# Altium project T8_SOM_Carrier.PrjPcb (part 3 of 4)

## Sheet ETHERNET.SchDoc: ETHERHET
size 420 x 297 mm; DrawnBy: Orhun Dabak; Revision: 1.0; SheetNumber: 5; SheetTotal: 8
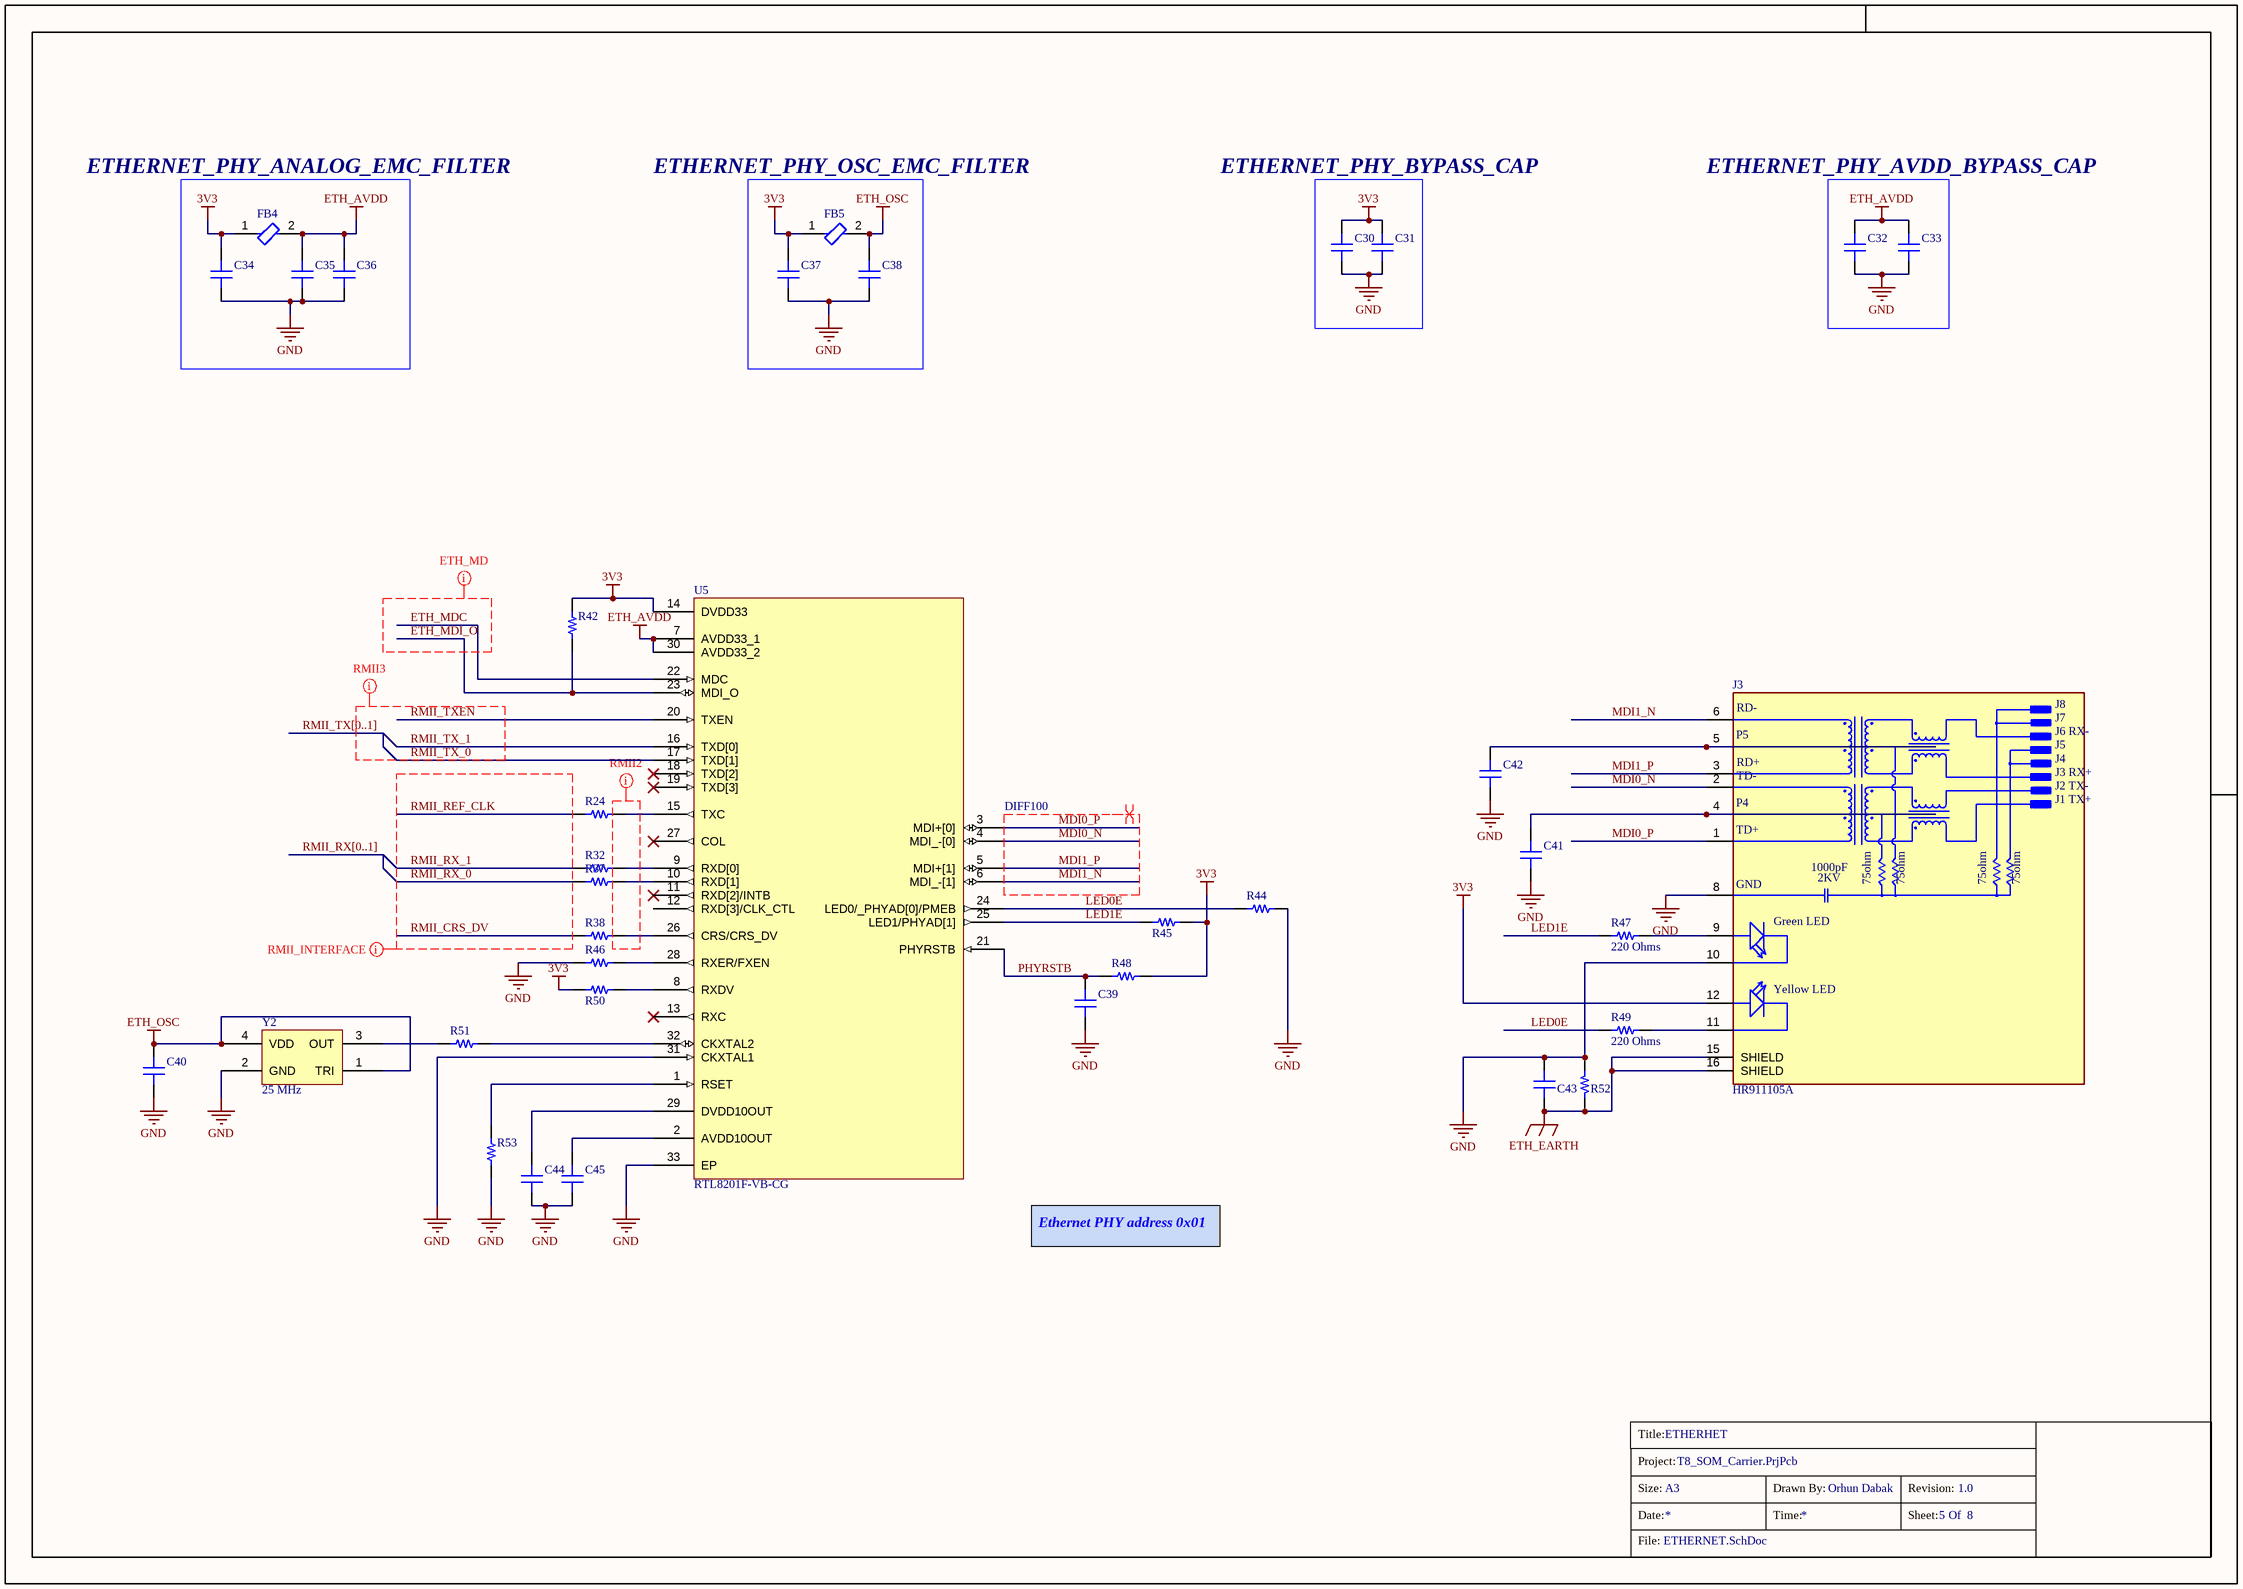
[diagram p4: ETHERNET.SchDoc]

### Parts
(Parts that share a designator on the sheet are numbered #1, #2 ... from top to bottom, then left to right.)
?#5  (no value)  (graphical)
C30  0.1 µF  [CAP 0402_1005]  (value not drawn)
C31  2.2 µF  [CAP 0402_1005]  (value not drawn)
C32  0.1 µF  [CAP 0402_1005]  (value not drawn)
C33  0.1 µF  [CAP 0402_1005]  (value not drawn)
C34  0.1 µF  [CAP 0402_1005]  (value not drawn)
C35  0.1 µF  [CAP 0402_1005]  (value not drawn)
C36  4.7 µF  [CAP 0402_1005]  (value not drawn)
C37  4.7 µF  [CAP 0402_1005]  (value not drawn)
C38  4.7 µF  [CAP 0402_1005]  (value not drawn)
C39  1000pF  [CAP 0402_1005]  (value not drawn)
C40  0.1 µF  [CAP 0402_1005]  (value not drawn)
C41  10000 pF  [CAP 0402_1005]  (value not drawn)
C42  10000 pF  [CAP 0402_1005]  (value not drawn)
C43  4700 pF  [CAP 0402_1005]  (value not drawn)
C44  0.1 µF  [CAP 0402_1005]  (value not drawn)
C45  0.1 µF  [CAP 0402_1005]  (value not drawn)
FB4  BLM15AX601SN1D  [FP-BLM15-0_05-IPC_B]  (value not drawn)
FB5  BLM15AX601SN1D  [FP-BLM15-0_05-IPC_B]  (value not drawn)
J3  HR911105A  [HANRUN_HR911105A]
R24  22 Ohms  [RES 0201_0603]  (value not drawn)
R32  22 Ohms  [RES 0201_0603]  (value not drawn)
R37  22 Ohms  [RES 0201_0603]  (value not drawn)
R38  22 Ohms  [RES 0201_0603]  (value not drawn)
R42  10 kOhms  [RES 0201_0603]  (value not drawn)
R44  4.7 kOhms  [RES 0201_0603]  (value not drawn)
R45  4.7 kOhms  [RES 0201_0603]  (value not drawn)
R46  4.7 kOhms  [RES 0201_0603]  (value not drawn)
R47  220 Ohms  [RES 0402_1005]
R48  4.7 kOhms  [RES 0201_0603]  (value not drawn)
R49  220 Ohms  [RES 0402_1005]
R50  10 kOhms  [RES 0201_0603]  (value not drawn)
R51  22 Ohms  [RES 0402_1005]  (value not drawn)
R52  1 MOhms  [RES 0402_1005]  (value not drawn)
R53  2.49 kOhms  [RES 0201_0603]  (value not drawn)
U5  RTL8201F-VB-CG  [QFN50P500X500X100_HS-33N]
Y2  25 MHz  [ABRACON ASE]

### Nets
3V3: C30.2 C31.2 C34.2 C37.2 FB4.1 FB5.1 J3.12(YA) R42.2 R45.1 R48.2 R50.2 U5.14(DVDD33)
ETH_AVDD: C32.2 C33.2 C35.2 C36.2 FB4.2 U5.7(AVDD33_1) U5.30(AVDD33_2)
ETH_EARTH: C43.1 J3.15(SHIELD) J3.16(SHIELD) R52.1
ETH_OSC: C38.2 C40.2 FB5.2 Y2.1(TRI) Y2.4(VDD)
GND: C30.1 C31.1 C32.1 C33.1 C34.1 C35.1 C36.1 C37.1 C38.1 C39.1 C40.1 C41.1 C42.1 C43.2 C44.1 C45.1 J3.8(GND) J3.10(GC) R44.2 R46.1 R52.2 R53.1 U5.31(CKXTAL1) U5.33(EP) Y2.2(GND)
ETH_MDC: U5.22(MDC)
ETH_MDI_O: R42.1 U5.23(MDI_O)
LED0E: R44.1 R49.2 U5.24(LED0/_PHYAD[0]/PMEB)
LED1E: R45.2 R47.2 U5.25(LED1/PHYAD[1])
MDI0_N: J3.2(TD-) U5.4(MDI_-[0])
MDI0_P: J3.1(TD+) U5.3(MDI+[0])
MDI1_N: J3.6(RD-) U5.6(MDI_-[1])
MDI1_P: J3.3(RD+) U5.5(MDI+[1])
PHYRSTB: C39.2 R48.1 U5.21(PHYRSTB)
RMII_CRS_DV: R38.1
RMII_REF_CLK: R24.1
RMII_RX_0: R37.1
RMII_RX_1: R32.1
RMII_TX_0: U5.17(TXD[1])
RMII_TX_1: U5.16(TXD[0])
RMII_TXEN: U5.20(TXEN)
NetC41_2: C41.2 J3.4(P4)
NetC42_2: C42.2 J3.5(P5)
NetC44_2: C44.2 U5.29(DVDD10OUT)
NetC45_2: C45.2 U5.2(AVDD10OUT)
NetJ3_9: J3.9(GA) R47.1
NetJ3_11: J3.11(YC) R49.1
NetR24_2: R24.2 U5.15(TXC)
NetR32_2: R32.2 U5.9(RXD[0])
NetR37_2: R37.2 U5.10(RXD[1])
NetR38_2: R38.2 U5.26(CRS/CRS_DV)
NetR46_2: R46.2 U5.28(RXER/FXEN)
NetR50_1: R50.1 U5.8(RXDV)
NetR51_1: R51.1 Y2.3(OUT)
NetR51_2: R51.2 U5.32(CKXTAL2)
NetR53_2: R53.2 U5.1(RSET)

Not connected (* = marked no-connect by the designer): U5 11(RXD[2]/INTB)* 12(RXD[3]/CLK_CTL) 13(RXC)* 18(TXD[2])* 19(TXD[3])* 27(COL)*

### Buses and harness runs
bus RMII_RX[0..1]
bus RMII_TX[0..1]

### Layout directives
net class SING_END50; net class RMII: RMII_CRS_DV, RMII_REF_CLK, RMII_RX_0, RMII_RX_1
differential pair; differential pair class DIFF100: MDI0_N, MDI0_P, MDI1_N, MDI1_P
net class RMII2; net class SING_END50: (no net found under the mark)
net class ETH_MD; net class SING_END50: ETH_MDC, ETH_MDI_O
net class RMII3; net class SING_END50: RMII_TX_0, RMII_TX_1, RMII_TXEN

### Notes on the sheet
- ETHERNET_PHY_ANALOG_EMC_FILTER
- ETHERNET_PHY_OSC_EMC_FILTER
- ETHERNET_PHY_BYPASS_CAP
- ETHERNET_PHY_AVDD_BYPASS_CAP
- Ethernet PHY address 0x01
- Title:
- Project:
- Size:
- Date:
- File:
- A3
- Time:
- Drawn By:
- Sheet:
- Revision:
- Of
- (in symbol HR911105A) J8; J7; J6 RX-; J5; J4; J3 RX+; J2 TX-; J1 TX+; 1000pF; 2KV; 75ohm; Green LED; Yellow LED

### Library data of the parts
?#5 = Title_Block
C30 C32-C35 C40 C44 C45 = CC0402KRX7R6BB104: CAP CER 0.1UF 10V X7R 0402; manufacturer: Yageo; Tolerance: ±10%; Part Number: CC0402KRX7R6BB104; Value: 0.1 µF; Applications: General Purpose; Capacitance: 0.1 µF; componentlink1description: Datasheet; componentlink1url: https://www.yageo.com/upload/media/product/productsearch/datasheet/mlcc/UPY-GPHC_X7R_6.3V-to-50V_18.pdf; componentlink2description: DigiKey Link; componentlink2url: https://www.digikey.com/en/products/detail/yageo/CC0402KRX7R6BB104/2103083; Device Package: 0402 (1005 Metric); lastupdated: 19/09/2022 12:57:28; Lifecycle Status: Active; Minimum Order: 1; Mounting Type: Surface Mount, MLCC; Operating Temperature: -55°C ~ 125°C; Package / Case: 0402 (1005 Metric); packaging: CutTape; partid: 3877; Part Status: Active; price: 0.01; series: CC; Size / Dimension: 0.039" L x 0.020" W (1.00mm x 0.50mm); Supplier 1: DigiKey; Supplier Part Number 1: 311-1345-1-ND; Temperature Coefficient: X7R; Thickness (Max): 0.022" (0.55mm); Voltage - Rated: 10V
C31 = C0402C225M8PAC7867: CAP CER 2.2UF 10V X5R 0402; manufacturer: KEMET; Tolerance: ±20%; Part Number: C0402C225M8PAC7867; Value: 2.2 µF; Applications: Bypass, Decoupling; Capacitance: 2.2 µF; componentlink1description: Datasheet; componentlink1url: https://connect.kemet.com:7667/gateway/IntelliData-ComponentDocumentation/1.0/download/datasheet/C0402C225M8PACTU; componentlink2description: DigiKey Link; componentlink2url: https://www.digikey.com/en/products/detail/kemet/C0402C225M8PAC7867/3317581; Device Package: 0402 (1005 Metric); lastupdated: 19/09/2022 12:56:38; Lifecycle Status: Active; Minimum Order: 1; Mounting Type: Surface Mount, MLCC; Operating Temperature: -55°C ~ 85°C; Package / Case: 0402 (1005 Metric); packaging: TapeAndReel; partid: 44976; Part Status: Active; price: 0.02; series: SMD Comm X5R; Size / Dimension: 0.039" L x 0.020" W (1.00mm x 0.50mm); Supplier 1: DigiKey; Supplier Part Number 1: 399-C0402C225M8PAC7867CT-ND; Temperature Coefficient: X5R; Thickness (Max): 0.022" (0.55mm); Voltage - Rated: 10V
C36-C38 = CL05A475MP5NRNC: CAP CER 4.7UF 10V X5R 0402; manufacturer: Samsung Electro-Mechanics; Tolerance: ±20%; Part Number: CL05A475MP5NRNC; Value: 4.7 µF; Applications: General Purpose; Capacitance: 4.7 µF; componentlink1description: Datasheet; componentlink1url: http://www.samsungsem.com/kr/support/product-search/mlcc/CL05A475MP5NRNC.jsp; componentlink2description: DigiKey Link; componentlink2url: https://www.digikey.com/en/products/detail/samsung-electro-mechanics/CL05A475MP5NRNC/3887140; Device Package: 0402 (1005 Metric); lastupdated: 19/09/2022 12:57:17; Lifecycle Status: Active; Minimum Order: 1; Mounting Type: Surface Mount, MLCC; Operating Temperature: -55°C ~ 85°C; Package / Case: 0402 (1005 Metric); packaging: TapeAndReel; partid: 7650; Part Status: Active; price: 0.01; series: CL; Size / Dimension: 0.039" L x 0.020" W (1.00mm x 0.50mm); Supplier 1: DigiKey; Supplier Part Number 1: 1276-1482-1-ND; Temperature Coefficient: X5R; Thickness (Max): 0.022" (0.55mm); Voltage - Rated: 10V
C39 = 0402ZC102KAT2A: CAP CER 1000PF 10V X7R 0402; manufacturer: AVX Corporation; Tolerance: ±10%; Part Number: 0402ZC102KAT2A; Value: 1000pF; Applications: General Purpose; Capacitance: 1000pF; componentlink1description: Datasheet; componentlink1url: http://datasheets.avx.com/X7RDielectric.pdf; componentlink2description: DigiKey Link; componentlink2url: http://digikey.com/product-detail/en/avx-corporation/0402ZC102KAT2A/478-12663-1-ND/9949195; Device Package: 0402 (1005 Metric); lastupdated: 08/02/2022 12:26:49; Lifecycle Status: Active; Minimum Order: 1; Mounting Type: Surface Mount, MLCC; Operating Temperature: -55°C ~ 125°C; Package / Case: 0402 (1005 Metric); packaging: TapeAndReel; partid: 7830; Part Status: Active; price: 0.01; series: -; Size / Dimension: 0.039" L x 0.020" W (1.00mm x 0.50mm); Supplier 1: DigiKey; Supplier Part Number 1: 478-12663-1-ND; Temperature Coefficient: X7R; Thickness (Max): 0.022" (0.56mm); Voltage - Rated: 10V
C41 C42 = C0402C103K5RECAUTO: CAP CER 0402 10NF 50V X7R 10%; manufacturer: KEMET; Part Number: C0402C103K5RECAUTO; Value: 10000 pF; Applications: Automotive, ESD Protection; Capacitance: 10000 pF; componentlink1description: Datasheet; componentlink1url: https://api.kemet.com/component-edge/download/datasheet/C0402C103K5RECAUTO.pdf; componentlink2description: DigiKey Link; componentlink2url: https://www.digikey.com/en/products/detail/kemet/C0402C103K5RECAUTO/8646477; Device Package: 0402 (1005 Metric); lastupdated: 19/09/2022 12:56:43; Lifecycle Status: Active; Minimum Order: 1; Mounting Type: Surface Mount, MLCC; Operating Temperature: -55°C ~ 125°C; Package / Case: 0402 (1005 Metric); packaging: TapeAndReel; partid: 38916; Part Status: Active; price: 0.01; Ratings: AEC-Q200; series: ESD SMD Auto X7R; Size / Dimension: 0.039" L x 0.020" W (1.00mm x 0.50mm); Supplier 1: DigiKey; Supplier Part Number 1: 399-C0402C103K5RECAUTOCT-ND; Temperature Coefficient: X7R; Thickness (Max): 0.022" (0.55mm); Tolerance: ±10%; Voltage - Rated: 50V
C43 = GRM155R72A472KA01D: CAP CER 4700PF 100V X7R 0402; manufacturer: Murata Electronics; Tolerance: ±10%; Part Number: GRM155R72A472KA01D; Value: 4700 pF; Applications: General Purpose; Capacitance: 4700 pF; componentlink1description: Datasheet; componentlink1url: https://www.murata.com/~/media/webrenewal/support/library/catalog/products/capacitor/mlcc/c02e.ashx?la=en-us; componentlink2description: DigiKey Link; componentlink2url: https://www.digikey.com/en/products/detail/murata-electronics/GRM155R72A472KA01D/965899; Device Package: 0402 (1005 Metric); lastupdated: 19/09/2022 12:57:33; Lifecycle Status: Active; Minimum Order: 1; Mounting Type: Surface Mount, MLCC; Operating Temperature: -55°C ~ 125°C; Package / Case: 0402 (1005 Metric); packaging: TapeAndReel; partid: 2046; Part Status: Active; price: 0.01; series: GRM; Size / Dimension: 0.039" L x 0.020" W (1.00mm x 0.50mm); Supplier 1: DigiKey; Supplier Part Number 1: 490-3885-1-ND; Temperature Coefficient: X7R; Thickness (Max): 0.022" (0.55mm); Voltage - Rated: 100V
FB4 FB5 = CMP-0686-00246-4: Chip Ferrite Bead, 0402, 600Ω @ 100MHz, 0.34Ω, 25%, 500mA; Material: Steel; DC Resistance (DCR): 340mR; Impedance: 600R; Number of Circuits: 1; Max Current Rating: 500mA; Core Material: Ferrite; Lead Free: Lead Free; Series: BLM15AX_SN; Number of Pins: 2; Package Quantity: 1; Length: 1mm; Height: 0.5mm; Width: 0.5mm; Packaging: Tape and Reel; RoHS Compliant: Yes; Test Frequency: 100MHz; Case Code (Imperial): 0402; Depth: 0.5mm; Case/Package: 0402; Min Operating Temperature: -55°C; Max Operating Temperature: 125°C; Max DC Current: 500mA; Current Rating: 500mA; REACH SVHC: No SVHC; Termination: SMD/SMT; Tolerance: 25%; Case Code (Metric): 1005; Number of Lines: 1; DC Resistance-Max: 340mR
J3 = HR911105A: DIP RJ45 Connector;; Package: None; MP: HR911105A; Value: *; Price: None; Availability: Unavailable
R24 R32 R37 R38 = ERJ-1GNF22R0C: RES SMD 22 OHM 1% 1/20W 0201; Manufacturer: Panasonic Electronic Components; Power (Watts): 0.05W, 1/20W; Temperature Coefficient: ±200ppm/°C; Part Number: ERJ-1GNF22R0C; Value: 22 Ohms; ComponentLink1Description: Datasheet; ComponentLink1URL: https://industrial.panasonic.com/cdbs/www-data/pdf/RDA0000/AOA0000C304.pdf; ComponentLink2Description: DigiKey Link; ComponentLink2URL: https://www.digikey.com/en/products/detail/panasonic-electronic-components/ERJ-1GNF22R0C/2035920; Composition: Thick Film; Device Package: 0201 (0603 Metric); Features: Automotive AEC-Q200; Height - Seated (Max): 0.010" (0.26mm); LastUpdated: 9/19/2022 01:09:14 PM; Lifecycle Status: Active; Minimum Order: 1; Number of Terminations: 2; Operating Temperature: -55°C ~ 125°C; Package / Case: 0201 (0603 Metric); Packaging: TapeAndReel; PartId: 823; Part Status: Active; Price: 0.01; Ratings: AEC-Q200; Resistance: 22 Ohms; Series: ERJ-1GN; Size / Dimension: 0.024" L x 0.012" W (0.60mm x 0.30mm); Supplier 1: DigiKey; Supplier Part Number 1: P122843CT-ND; Supplier Device Package: 0201; Tolerance: ±1%
R42 R50 = RC0201FR-0710KL: RES 10K OHM 1% 1/20W 0201; Manufacturer: Yageo; Power (Watts): 0.05W, 1/20W; Temperature Coefficient: ±200ppm/°C; Part Number: RC0201FR-0710KL; Value: 10 kOhms; ComponentLink1Description: Datasheet; ComponentLink1URL: https://www.yageo.com/upload/media/product/productsearch/datasheet/rchip/PYu-RC_Group_51_RoHS_L_10.pdf; ComponentLink2Description: DigiKey Link; ComponentLink2URL: https://www.digikey.com/en/products/detail/yageo/RC0201FR-0710KL/1948870; Composition: Thick Film; Device Package: 0201 (0603 Metric); Features: Moisture Resistant; Height - Seated (Max): 0.010" (0.26mm); LastUpdated: 19/09/2022 13:09:03; Lifecycle Status: Active; Minimum Order: 1; Number of Terminations: 2; Operating Temperature: -55°C ~ 125°C; Package / Case: 0201 (0603 Metric); Packaging: CutTape; PartId: 2281; Part Status: Active; Price: 0.01; Resistance: 10 kOhms; Series: RC_L; Size / Dimension: 0.024" L x 0.012" W (0.60mm x 0.30mm); Supplier 1: DigiKey; Supplier Part Number 1: 311-10.0KMCT-ND; Supplier Device Package: 0201; Tolerance: ±1%
R44-R46 R48 = RC0201FR-074K7L: RES 4.7K OHM 1% 1/20W 0201; Manufacturer: Yageo; Power (Watts): 0.05W, 1/20W; Temperature Coefficient: ±200ppm/°C; Part Number: RC0201FR-074K7L; Value: 4.7 kOhms; ComponentLink1Description: Datasheet; ComponentLink1URL: https://www.yageo.com/upload/media/product/productsearch/datasheet/rchip/PYu-RC_Group_51_RoHS_L_10.pdf; ComponentLink2Description: DigiKey Link; ComponentLink2URL: https://www.digikey.com/en/products/detail/yageo/RC0201FR-074K7L/1948894; Composition: Thick Film; Device Package: 0201 (0603 Metric); Features: Moisture Resistant; Height - Seated (Max): 0.010" (0.26mm); LastUpdated: 19/09/2022 13:09:03; Lifecycle Status: Active; Minimum Order: 1; Number of Terminations: 2; Operating Temperature: -55°C ~ 125°C; Package / Case: 0201 (0603 Metric); Packaging: CutTape; PartId: 2288; Part Status: Active; Price: 0.01; Resistance: 4.7 kOhms; Series: RC_L; Size / Dimension: 0.024" L x 0.012" W (0.60mm x 0.30mm); Supplier 1: DigiKey; Supplier Part Number 1: 311-4.70KMCT-ND; Supplier Device Package: 0201; Tolerance: ±1%
R47 R49 = RC0402FR-07220RL: RES 220 OHM 1% 1/16W 0402; Manufacturer: Yageo; Power (Watts): 0.063W, 1/16W; Temperature Coefficient: ±100ppm/°C; Part Number: RC0402FR-07220RL; Value: 220 Ohms; ComponentLink1Description: Datasheet; ComponentLink1URL: https://www.yageo.com/upload/media/product/productsearch/datasheet/rchip/PYu-RC_Group_51_RoHS_L_10.pdf; ComponentLink2Description: DigiKey Link; ComponentLink2URL: https://www.digikey.com/en/products/detail/yageo/RC0402FR-07220RL/726565; Composition: Thick Film; Device Package: 0402 (1005 Metric); Features: Moisture Resistant; Height - Seated (Max): 0.016" (0.40mm); LastUpdated: 19/09/2022 13:14:14; Lifecycle Status: Active; Minimum Order: 1; Number of Terminations: 2; Operating Temperature: -55°C ~ 155°C; Package / Case: 0402 (1005 Metric); Packaging: CutTape; PartId: 17956; Part Status: Active; Price: 0.01; Resistance: 220 Ohms; Series: RC_L; Size / Dimension: 0.039" L x 0.020" W (1.00mm x 0.50mm); Supplier 1: DigiKey; Supplier Part Number 1: 311-220LRCT-ND; Supplier Device Package: 0402; Tolerance: ±1%
R51 = RC0402FR-0722RL: RES 22 OHM 1% 1/16W 0402; Manufacturer: Yageo; Power (Watts): 0.063W, 1/16W; Temperature Coefficient: ±100ppm/°C; Part Number: RC0402FR-0722RL; Value: 22 Ohms; ComponentLink1Description: Datasheet; ComponentLink1URL: https://www.yageo.com/upload/media/product/productsearch/datasheet/rchip/PYu-RC_Group_51_RoHS_L_10.pdf; ComponentLink2Description: DigiKey Link; ComponentLink2URL: https://www.digikey.com/en/products/detail/yageo/RC0402FR-0722RL/726562; Composition: Thick Film; Device Package: 0402 (1005 Metric); Features: Moisture Resistant; Height - Seated (Max): 0.016" (0.40mm); LastUpdated: 19/09/2022 13:14:15; Lifecycle Status: Active; Minimum Order: 1; Number of Terminations: 2; Operating Temperature: -55°C ~ 155°C; Package / Case: 0402 (1005 Metric); Packaging: CutTape; PartId: 17600; Part Status: Active; Price: 0.01; Resistance: 22 Ohms; Series: RC_L; Size / Dimension: 0.039" L x 0.020" W (1.00mm x 0.50mm); Supplier 1: DigiKey; Supplier Part Number 1: 311-22.0LRCT-ND; Supplier Device Package: 0402; Tolerance: ±1%
R52 = AC0402FR-071ML: RES SMD 1M OHM 1% 1/16W 0402; Manufacturer: Yageo; Power (Watts): 0.063W, 1/16W; Temperature Coefficient: ±100ppm/°C; Part Number: AC0402FR-071ML; Value: 1 MOhms; ComponentLink1Description: Datasheet; ComponentLink1URL: https://www.yageo.com/upload/media/product/productsearch/datasheet/rchip/PYu-AC_51_RoHS_L_7.pdf; ComponentLink2Description: DigiKey Link; ComponentLink2URL: https://www.digikey.com/en/products/detail/yageo/AC0402FR-071ML/5895164; Composition: Thick Film; Device Package: 0402 (1005 Metric); Features: Automotive AEC-Q200, Moisture Resistant; Height - Seated (Max): 0.015" (0.37mm); LastUpdated: 19/09/2022 13:14:31; Lifecycle Status: Active; Minimum Order: 1; Number of Terminations: 2; Operating Temperature: -55°C ~ 155°C; Package / Case: 0402 (1005 Metric); Packaging: CutTape; PartId: 12043; Part Status: Active; Price: 0.01; Ratings: AEC-Q200; Resistance: 1 MOhms; Series: AC; Size / Dimension: 0.039" L x 0.020" W (1.00mm x 0.50mm); Supplier 1: DigiKey; Supplier Part Number 1: YAG3450CT-ND; Supplier Device Package: 0402; Tolerance: ±1%
R53 = RC0201FR-072K49L: RES 2.49K OHM 1% 1/20W 0201; Manufacturer: Yageo; Power (Watts): 0.05W, 1/20W; Temperature Coefficient: ±200ppm/°C; Part Number: RC0201FR-072K49L; Value: 2.49 kOhms; ComponentLink1Description: Datasheet; ComponentLink1URL: https://www.yageo.com/upload/media/product/productsearch/datasheet/rchip/PYu-RC_Group_51_RoHS_L_10.pdf; ComponentLink2Description: DigiKey Link; ComponentLink2URL: https://www.digikey.com/en/products/detail/yageo/RC0201FR-072K49L/3202399; Composition: Thick Film; Device Package: 0201 (0603 Metric); Features: Moisture Resistant; Height - Seated (Max): 0.010" (0.26mm); LastUpdated: 19/09/2022 13:09:06; Lifecycle Status: Active; Minimum Order: 1; Number of Terminations: 2; Operating Temperature: -55°C ~ 125°C; Package / Case: 0201 (0603 Metric); Packaging: CutTape; PartId: 1844; Part Status: Active; Price: 0.01; Resistance: 2.49 kOhms; Series: RC_L; Size / Dimension: 0.024" L x 0.012" W (0.60mm x 0.30mm); Supplier 1: DigiKey; Supplier Part Number 1: YAG2338CT-ND; Supplier Device Package: 0201; Tolerance: ±1%
U5 = RTL8201F-VB-CG: Physical Layer Transceivers 2.97V ~ 3.63V IEEE 802.3, 10/100 Base-T/TX/FX PHY MII, SNI, SMI QFN-32_5x5x05P Ethernet ICs ROHS; Manufacturer: Realtek Semicon; ComponentLink1Description: LCSC Link; ComponentLink1URL: https://www.lcsc.com/product-detail/Ethernet-ICs_Realtek-Semicon-RTL8201F-VB-CG_C45044.html; ComponentLink2Description: Datasheet; ComponentLink2URL: https://datasheetspdf.com/pdf-file/845737/Realtek/RTL8201F-VB-CG/1; Manufacturer Part Number: RTL8201F-VB-CG; Category: Communication Interface Chip/UART/485/232/Ethernet ICs; Type: Physical Layer Transceivers; Supply Voltage: 2.97V ~ 3.63V; Standards: IEEE 802.3, 10/100 Base-T/TX/FX PHY; Interface: MII, SNI, SMI; Package: QFN-32_5x5x05P; Supplier 1: Bison Technologies; Supplier Part Number 1: RTL8201F-VB-CG-220741-REALTEK; Supplier 2: Future Electronics; Supplier Part Number 2: 4019222
Y2 = ASE-25.000MHZ-ET: XTAL OSC XO 25.0000MHZ CMOS SMD; Manufacturer: Abracon LLC; Base Resonator: Crystal; Current - Supply (Max): 13mA; Frequency Stability: ±100ppm; Function: Enable/Disable; Voltage - Supply: 3.3V; Part Number: ASE-25.000MHZ-ET; ComponentLink1Description: Datasheet; ComponentLink1URL: https://abracon.com/Oscillators/ASEseries.pdf; ComponentLink2Description: DigiKey Link; ComponentLink2URL: https://www.digikey.com/en/products/detail/abracon-llc/ASE-25-000MHZ-ET/2001354; Frequency: 25 MHz; Height - Seated (Max): 0.047" (1.20mm); LastUpdated: 19/09/2022 13:51:44; Lifecycle Status: Active; Minimum Order: 1; Mounting Type: Surface Mount; Operating Temperature: -20°C ~ 70°C; Output: CMOS; Package / Case: 4-SMD, No Lead; Packaging: TapeAndReel; PartId: 149; Part Status: Active; Price: 0.88; Series: ASE; Size / Dimension: 0.126" L x 0.098" W (3.20mm x 2.50mm); Supplier 1: DigiKey; Supplier Part Number 1: 535-9987-1-ND; Type: XO (Standard); Value: 25 MHz

## Sheet ESP32_PD.SchDoc
size Legal; DrawnBy: Orhun Dabak; SheetNumber: 6; SheetTotal: 8
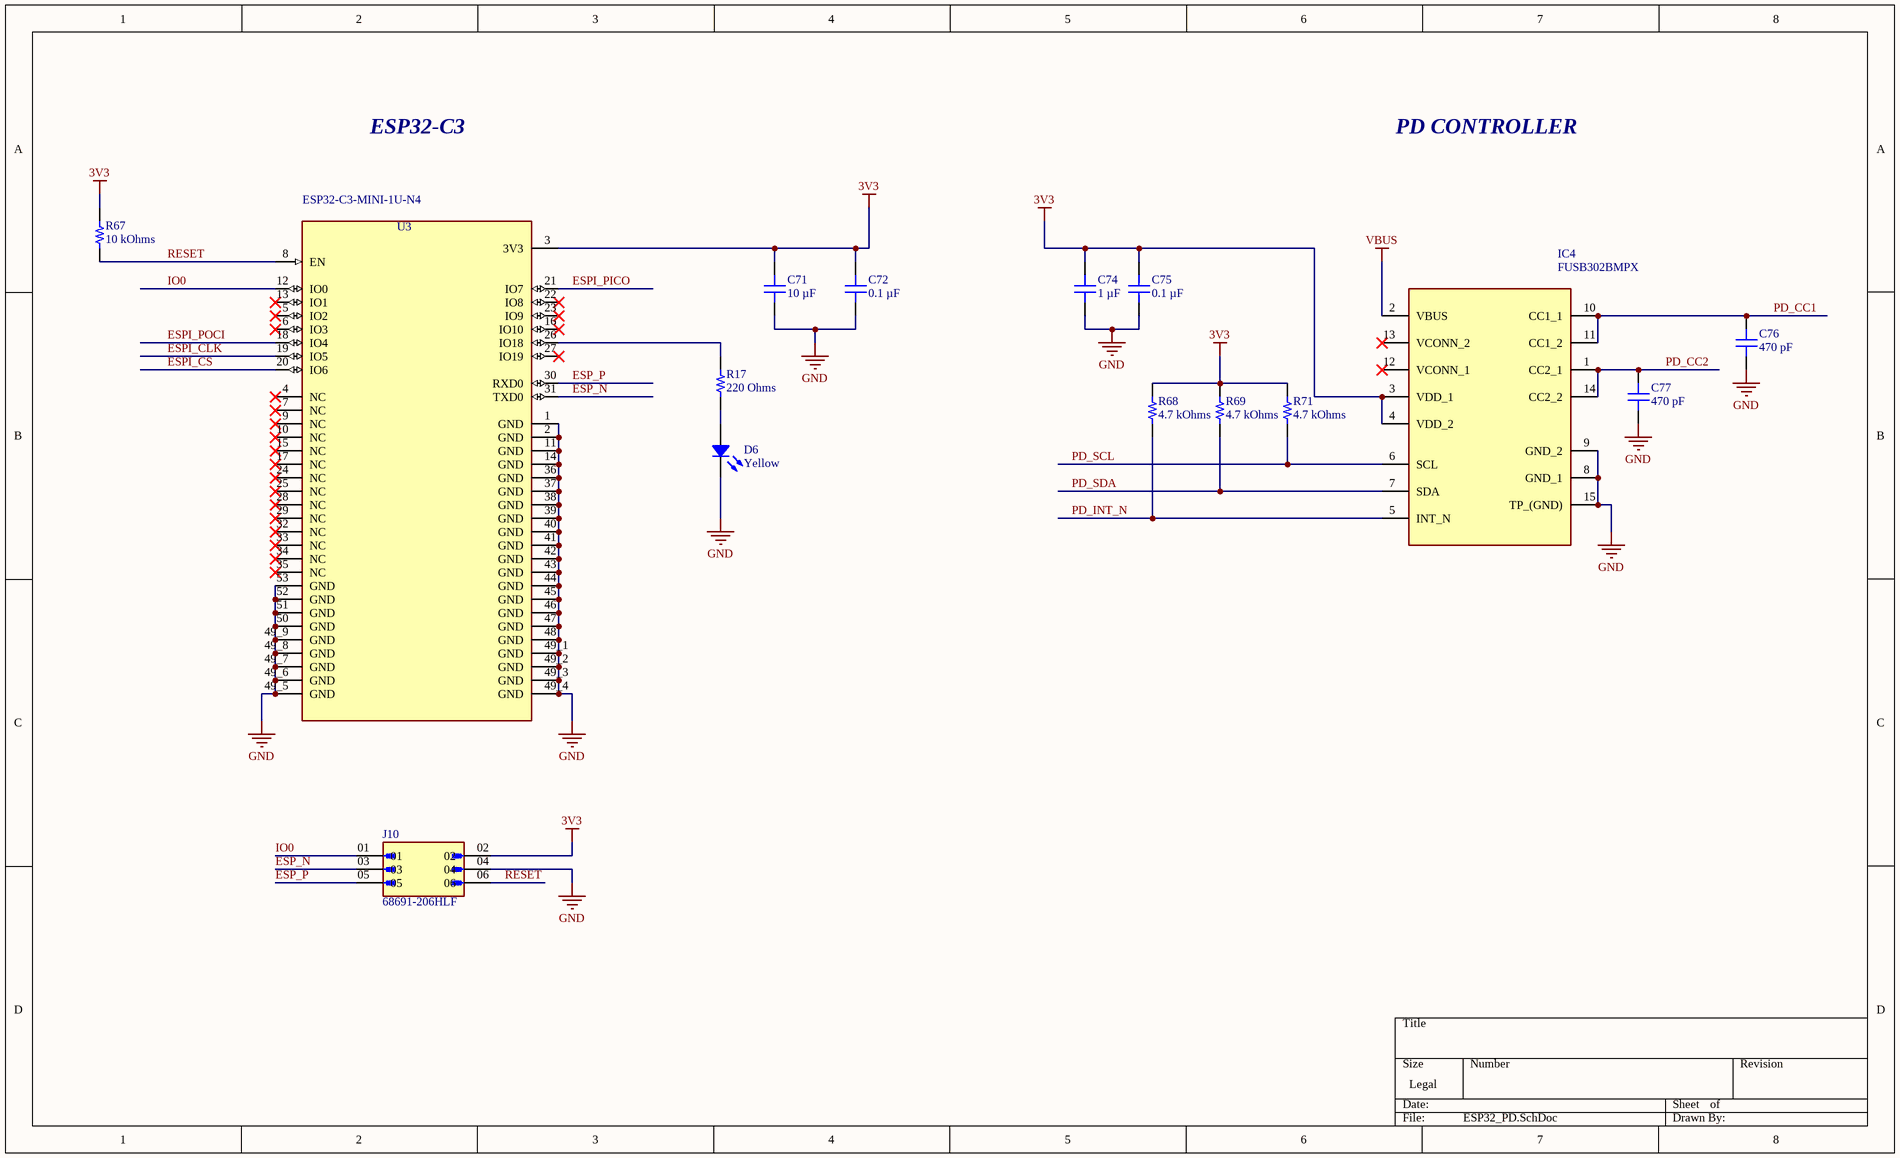
[diagram p5: ESP32_PD.SchDoc]

### Parts
C71  10 µF  [CAP 0603_1608]
C72  0.1 µF  [CAP 0603_1608]
C74  1 µF  [CAP 0603_1608]
C75  0.1 µF  [CAP 0402_1005]
C76  470 pF  [CAP 0402_1005]
C77  470 pF  [CAP 0402_1005]
D6  Yellow  [LED 0603_1608 YELLOW]
IC4  FUSB302BMPX  [QFN50P250X250X80-15N]
J10  68691-206HLF  [AMPHENOL_68691-206HLF]
R17  220 Ohms  [RES 0402_1005]
R67  10 kOhms  [RES 0402_1005]
R68  4.7 kOhms  [RES 0402_1005]
R69  4.7 kOhms  [RES 0402_1005]
R71  4.7 kOhms  [RES 0402_1005]
U3  ESP32-C3-MINI-1U-N4  [XCVR_ESP32-C3-MINI-1U-N4]

### Nets
3V3: C71.2 C72.2 C74.2 C75.2 IC4.3(VDD_1) IC4.4(VDD_2) J10.02 R67.2 R68.2 R69.2 R71.2 U3.3(3V3)
GND: C71.1 C72.1 C74.1 C75.1 C76.1 C77.1 D6.2 IC4.8(GND_1) IC4.9(GND_2) IC4.15(TP_(GND)) J10.04 U3.1(GND) U3.2(GND) U3.11(GND) U3.14(GND) U3.36(GND) U3.37(GND) U3.38(GND) U3.39(GND) U3.40(GND) U3.41(GND) U3.42(GND) U3.43(GND) U3.44(GND) U3.45(GND) U3.46(GND) U3.47(GND) U3.48(GND) U3.49_1(GND) U3.49_2(GND) U3.49_3(GND) U3.49_4(GND) U3.49_5(GND) U3.49_6(GND) U3.49_7(GND) U3.49_8(GND) U3.49_9(GND) U3.50(GND) U3.51(GND) U3.52(GND) U3.53(GND)
VBUS: IC4.2(VBUS)
ESP_N: J10.03 U3.31(TXD0)
ESP_P: J10.05 U3.30(RXD0)
ESPI_CLK: U3.19(IO5)
ESPI_CS: U3.20(IO6)
ESPI_PICO: U3.21(IO7)
ESPI_POCI: U3.18(IO4)
IO0: J10.01 U3.12(IO0)
PD_CC1: C76.2 IC4.10(CC1_1) IC4.11(CC1_2)
PD_CC2: C77.2 IC4.1(CC2_1) IC4.14(CC2_2)
PD_INT_N: IC4.5(INT_N) R68.1
PD_SCL: IC4.6(SCL) R71.1
PD_SDA: IC4.7(SDA) R69.1
RESET: J10.06 R67.1 U3.8(EN)
NetD6_1: D6.1 R17.2
NetR17_1: R17.1 U3.26(IO18)

Not connected (* = marked no-connect by the designer): IC4 12(VCONN_1)* 13(VCONN_2)*; U3 4(NC)* 5(IO2)* 6(IO3)* 7(NC)* 9(NC)* 10(NC)* 13(IO1)* 15(NC)* 16(IO10)* 17(NC)* 22(IO8)* 23(IO9)* 24(NC)* 25(NC)* 27(IO19)* 28(NC)* 29(NC)* 32(NC)* 33(NC)* 34(NC)* 35(NC)*

### Notes on the sheet
- ESP32-C3
- PD CONTROLLER

### Library data of the parts
C71 = GRM188R60J106ME47D: CAP CER 10UF 6.3V X5R 0603; manufacturer: Murata Electronics; Tolerance: ±20%; Part Number: GRM188R60J106ME47D; Value: 10 µF; Applications: General Purpose; Capacitance: 10 µF; componentlink1description: Datasheet; componentlink1url: https://www.murata.com/~/media/webrenewal/support/library/catalog/products/capacitor/mlcc/c02e.ashx?la=en-us; componentlink2description: DigiKey Link; componentlink2url: https://www.digikey.com/en/products/detail/murata-electronics/GRM188R60J106ME47D/965910; Device Package: 0603 (1608 Metric); lastupdated: 9/19/2022 01:01:20 PM; Lifecycle Status: Active; Minimum Order: 1; Mounting Type: Surface Mount, MLCC; Operating Temperature: -55°C ~ 85°C; Package / Case: 0603 (1608 Metric); packaging: TapeAndReel; partid: 2351; Part Status: Active; price: 0.02; series: GRM; Size / Dimension: 0.063" L x 0.031" W (1.60mm x 0.80mm); Supplier 1: DigiKey; Supplier Part Number 1: 490-3896-1-ND; Temperature Coefficient: X5R; Thickness (Max): 0.035" (0.90mm); Voltage - Rated: 6.3V
C72 = 6R3X14W104MV4T: CAP CER 0.1UF 6.3V X7R 0603; manufacturer: Johanson Dielectrics Inc.; Tolerance: ±20%; Part Number: 6R3X14W104MV4T; Value: 0.1 µF; Applications: Bypass, Decoupling; Capacitance: 0.1 µF; componentlink1description: Datasheet; componentlink1url: https://www.johansondielectrics.com/downloads/x2y-filter-and-decoupling-capacitors.pdf; componentlink2description: DigiKey Link; componentlink2url: https://www.digikey.com/en/products/detail/johanson-dielectrics-inc/6R3X14W104MV4T/1556331; Device Package: 0603 (1608 Metric); Features: Low ESL (X2Y); lastupdated: 9/19/2022 01:01:19 PM; Lifecycle Status: Active; Minimum Order: 1; Mounting Type: Surface Mount, MLCC; Operating Temperature: -55°C ~ 125°C; Package / Case: 0603 (1608 Metric); packaging: TapeAndReel; partid: 2650; Part Status: Active; price: 0.08; series: X2Y®; Size / Dimension: 0.064" L x 0.035" W (1.63mm x 0.89mm); Supplier 1: DigiKey; Supplier Part Number 1: 709-1009-1-ND; Temperature Coefficient: X7R; Thickness (Max): 0.026" (0.66mm); Voltage - Rated: 6.3V
C74 = C0603C105K4RACAUTO: CAP CER 1UF 16V X7R 0603; manufacturer: KEMET; Tolerance: ±10%; Part Number: C0603C105K4RACAUTO; Value: 1 µF; Applications: Automotive, Bypass, Decoupling; Capacitance: 1 µF; componentlink1description: Datasheet; componentlink1url: https://api.kemet.com/component-edge/download/datasheet/C0603C105K4RACAUTO.pdf; componentlink2description: DigiKey Link; componentlink2url: https://www.digikey.com/en/products/detail/kemet/C0603C105K4RACAUTO/8635831; Device Package: 0603 (1608 Metric); lastupdated: 9/19/2022 01:01:20 PM; Lifecycle Status: Active; Minimum Order: 0; Mounting Type: Surface Mount, MLCC; Operating Temperature: -55°C ~ 125°C; Package / Case: 0603 (1608 Metric); partid: 2179; Part Status: Active; price: 0; Ratings: AEC-Q200; series: SMD Auto X7R; Size / Dimension: 0.063" L x 0.031" W (1.60mm x 0.80mm); Supplier 1: DigiKey; Supplier Part Number 1: 399-17704-2-ND; Temperature Coefficient: X7R; Thickness (Max): 0.037" (0.95mm); Voltage - Rated: 16V
C75 = C0402C104K4RECAUTO: CAP CER 0402 0.1UF 16V X7R 10%; manufacturer: KEMET; Part Number: C0402C104K4RECAUTO; Value: 0.1 µF; Applications: Automotive, ESD Protection; Capacitance: 0.1 µF; componentlink1description: Datasheet; componentlink1url: https://api.kemet.com/component-edge/download/datasheet/C0402C104K4RECAUTO.pdf; componentlink2description: DigiKey Link; componentlink2url: https://www.digikey.com/en/products/detail/kemet/C0402C104K4RECAUTO/8563695; Device Package: 0402 (1005 Metric); lastupdated: 9/19/2022 12:57:36 PM; Lifecycle Status: Active; Minimum Order: 1; Mounting Type: Surface Mount, MLCC; Operating Temperature: -55°C ~ 125°C; Package / Case: 0402 (1005 Metric); packaging: TapeAndReel; partid: 1731; Part Status: Active; price: 0.01; Ratings: AEC-Q200; series: ESD SMD Auto X7R; Size / Dimension: 0.039" L x 0.020" W (1.00mm x 0.50mm); Supplier 1: DigiKey; Supplier Part Number 1: 399-17167-1-ND; Temperature Coefficient: X7R; Thickness (Max): 0.022" (0.55mm); Tolerance: ±10%; Voltage - Rated: 16V
C76 C77 = C0402C471J5GACAUTO: CAP CER 470PF 50V C0G/NP0 0402; manufacturer: KEMET; Temperature Coefficient: C0G, NP0; Tolerance: ±5%; Part Number: C0402C471J5GACAUTO; Value: 470 pF; Applications: Automotive; Capacitance: 470 pF; componentlink1description: Datasheet; componentlink1url: https://api.kemet.com/component-edge/download/datasheet/C0402C471J5GACAUTO.pdf; componentlink2description: DigiKey Link; componentlink2url: https://www.digikey.com/en/products/detail/kemet/C0402C471J5GACAUTO/7516239; Device Package: 0402 (1005 Metric); Features: Low ESL; lastupdated: 9/19/2022 12:57:36 PM; Lifecycle Status: Active; Minimum Order: 1; Mounting Type: Surface Mount, MLCC; Operating Temperature: -55°C ~ 125°C; Package / Case: 0402 (1005 Metric); packaging: TapeAndReel; partid: 1747; Part Status: Active; price: 0.06; Ratings: AEC-Q200; series: SMD Auto C0G; Size / Dimension: 0.039" L x 0.020" W (1.00mm x 0.50mm); Supplier 1: DigiKey; Supplier Part Number 1: 399-16006-1-ND; Thickness (Max): 0.022" (0.55mm); Voltage - Rated: 50V
D6 = SML-LX0603YW-TR: LED YELLOW DIFFUSED SMD; Manufacturer: Lumex Opto/Components Inc.; Configuration: Standard; Current - Test: 20mA; Lens Color: White; Lens Size: 1.00mm x 0.80mm; Lens Style: Rectangle with Flat Top; Millicandela Rating: 14mcd; Viewing Angle: 160°; Voltage - Forward (Vf) (Typ): 2.1V; Wavelength - Peak: 585nm; Part Number: SML-LX0603YW-TR; Color: Yellow; ComponentLink1Description: Datasheet; ComponentLink1URL: https://www.lumex.com/content/files/ProductAttachment/SML-LX0603YW-TR.pdf; ComponentLink2Description: DigiKey Link; ComponentLink2URL: https://www.digikey.com/en/products/detail/lumex-opto-components-inc/SML-LX0603YW-TR/304361; Device Package: 0603 (1608 Metric); Height (Max): 0.60mm; LastUpdated: 19/09/2022 13:51:05; Lens Transparency: Diffused; Lifecycle Status: Active; Minimum Order: 1; Mounting Type: Surface Mount; Package / Case: 0603 (1608 Metric); Packaging: TapeAndReel; PartId: 92; Part Status: Active; Price: 0.05; Series: -; Size / Dimension: 1.60mm L x 0.80mm W; Supplier 1: DigiKey; Supplier Part Number 1: 67-1550-1-ND; Value: Yellow
IC4 = FUSB302BMPX: Integrated Circuit; Manufacturer_Name: onsemi; Datasheet Link: https://www.onsemi.com/pub/Collateral/FUSB302B-D.PDF; Height: 0.8mm; Manufacturer_Part_Number: FUSB302BMPX; Mouser Part Number: 512-FUSB302BMPX; Mouser Price/Stock: https://www.mouser.co.uk/ProductDetail/ON-Semiconductor-Fairchild/FUSB302BMPX?qs=8ziscO3x5y1SHqdwooDK6g%3D%3D; Arrow Part Number: FUSB302BMPX; Arrow Price/Stock: https://www.arrow.com/en/products/fusb302bmpx/on-semiconductor?region=nac
J10 = 68691-206HLF: Connector Header Through Hole 6 position 0.100 (2.54mm); MF: FCI; Package: None; Purchase-URL: https://pricing.snapeda.com/search/part/68691-206HLF/?ref=eda; Value: *; MP: 68691-206HLF; Price: None; SnapEDA_Link: https://www.snapeda.com/parts/68691-206HLF/Amphenol+FCI/view-part/?ref=snap; Check_prices: https://www.snapeda.com/parts/68691-206HLF/Amphenol+FCI/view-part/?ref=eda; Availability: In Stock
R17 = RC0402FR-07220RL: as R47 on sheet ETHERNET; Part Number: RC0402FR-07220RL; Value: 220 Ohms; ComponentLink1Description: Datasheet; ComponentLink1URL: https://www.yageo.com/upload/media/product/productsearch/datasheet/rchip/PYu-RC_Group_51_RoHS_L_10.pdf; ComponentLink2Description: DigiKey Link; ComponentLink2URL: https://www.digikey.com/en/products/detail/yageo/RC0402FR-07220RL/726565; Composition: Thick Film; Device Package: 0402 (1005 Metric); Features: Moisture Resistant; Height - Seated (Max): 0.016" (0.40mm); LastUpdated: 19/09/2022 13:14:14; Lifecycle Status: Active; Minimum Order: 1; Number of Terminations: 2; Operating Temperature: -55°C ~ 155°C; Package / Case: 0402 (1005 Metric); Packaging: CutTape; PartId: 17956; Part Status: Active; Price: 0.01; Resistance: 220 Ohms; Series: RC_L; Size / Dimension: 0.039" L x 0.020" W (1.00mm x 0.50mm); Supplier 1: DigiKey; Supplier Part Number 1: 311-220LRCT-ND; Supplier Device Package: 0402; Tolerance: ±1%
R67 = RP73PF1E10KBTD: RES 10K OHM 0.1% 1/10W 0402; Manufacturer: TE Connectivity Passive Product; Power (Watts): 0.1W, 1/10W; Temperature Coefficient: ±25ppm/°C; Part Number: RP73PF1E10KBTD; Value: 10 kOhms; ComponentLink1Description: Datasheet; ComponentLink1URL: https://www.te.com/commerce/DocumentDelivery/DDEController?Action=srchrtrv&DocNm=1773272&DocType=DS&DocLang=English; ComponentLink2Description: DigiKey Link; ComponentLink2URL: https://www.digikey.com/en/products/detail/te-connectivity-passive-product/RP73PF1E10KBTD/8260957; Composition: Thin Film; Device Package: 0402 (1005 Metric); Height - Seated (Max): 0.014" (0.35mm); LastUpdated: 9/19/2022 01:15:04 PM; Lifecycle Status: Active; Minimum Order: 1; Number of Terminations: 2; Operating Temperature: -55°C ~ 155°C; Package / Case: 0402 (1005 Metric); Packaging: TapeAndReel; PartId: 2434; Part Status: Active; Price: 0.09; Resistance: 10 kOhms; Series: RP73, Holsworthy; Size / Dimension: 0.039" L x 0.020" W (1.00mm x 0.50mm); Supplier 1: DigiKey; Supplier Part Number 1: A127415CT-ND; Supplier Device Package: 0402; Tolerance: ±0.1%
R68 R69 R71 = RT0402FRE074K7L: RES SMD 4.7K OHM 1% 1/16W 0402; Manufacturer: Yageo; Power (Watts): 0.063W, 1/16W; Temperature Coefficient: ±50ppm/°C; Part Number: RT0402FRE074K7L; Value: 4.7 kOhms; ComponentLink1Description: Datasheet; ComponentLink1URL: https://www.yageo.com/upload/media/product/productsearch/datasheet/rchip/PYu-RT_1-to-0.01_RoHS_L_11.pdf; ComponentLink2Description: DigiKey Link; ComponentLink2URL: https://www.digikey.com/en/products/detail/yageo/RT0402FRE074K7L/1072052; Composition: Thin Film; Device Package: 0402 (1005 Metric); Height - Seated (Max): 0.014" (0.35mm); LastUpdated: 9/19/2022 01:15:02 PM; Lifecycle Status: Active; Minimum Order: 1; Number of Terminations: 2; Operating Temperature: -55°C ~ 155°C; Package / Case: 0402 (1005 Metric); Packaging: TapeAndReel; PartId: 3198; Part Status: Active; Price: 0.01; Resistance: 4.7 kOhms; Series: RT; Size / Dimension: 0.039" L x 0.020" W (1.00mm x 0.50mm); Supplier 1: DigiKey; Supplier Part Number 1: YAG3347CT-ND; Supplier Device Package: 0402; Tolerance: ±1%
U3 = ESP32-C3-MINI-1U-N4: Bluetooth, WiFi 802.11b/g/n, Bluetooth v5.0 Transceiver Module 2.412GHz ~ 2.484GHz Antenna Not Included, I-PEX Surface Mount; MF: Espressif Systems; SnapEDA_Link: https://www.snapeda.com/parts/ESP32-C3-MINI-1U-N4/Espressif+Systems/view-part/?ref=snap; Check_prices: https://www.snapeda.com/parts/ESP32-C3-MINI-1U-N4/Espressif+Systems/view-part/?ref=eda; Digi-Key_Part_Number: 1965-ESP32-C3-MINI-1U-N4TR-ND; Package: None; Purchase-URL: https://pricing.snapeda.com/search/part/ESP32-C3-MINI-1U-N4/?ref=eda; Value: *; MP: ESP32-C3-MINI-1U-N4

## Sheet SYZYGY_BOARD_CONN.SchDoc: ARDUINO_SYZGY
size 420 x 297 mm; DrawnBy: Orhun Dabak; Revision: 1.0; SheetNumber: 7; SheetTotal: 8
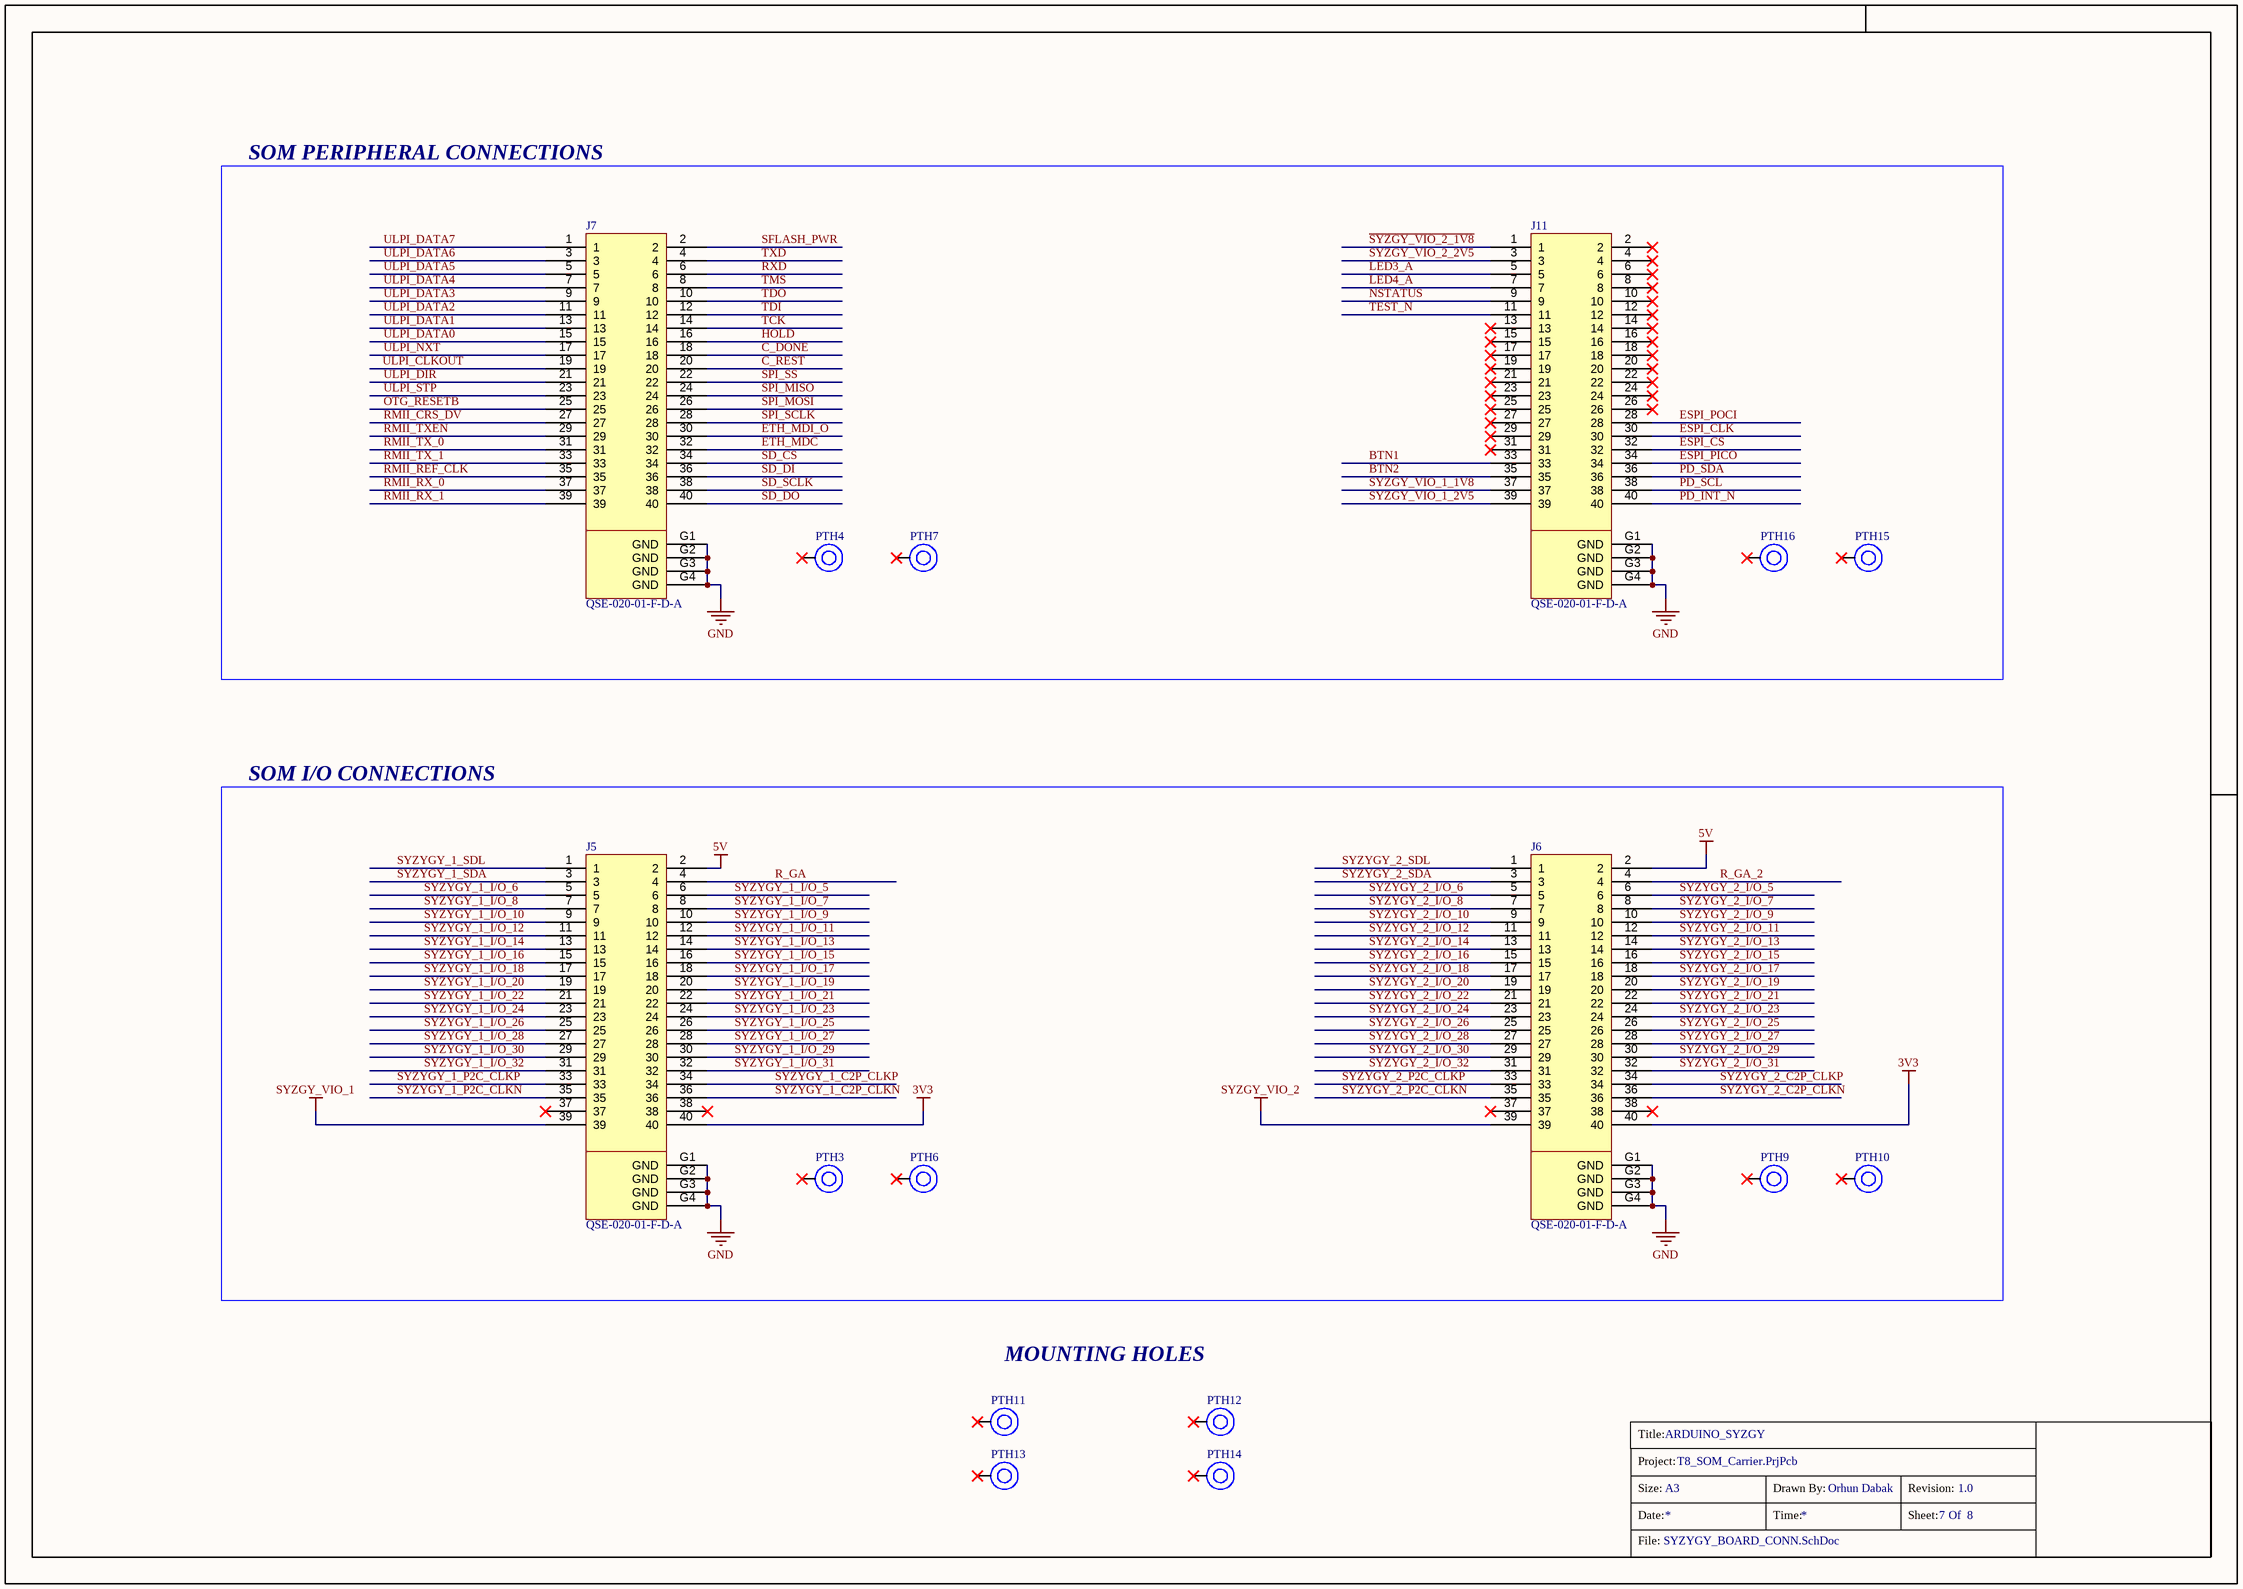
[diagram p6: SYZYGY_BOARD_CONN.SchDoc]

### Parts
(Parts that share a designator on the sheet are numbered #1, #2 ... from top to bottom, then left to right.)
?#6  (no value)  (graphical)
J5  QSE-020-01-F-D-A  [QSE-020-01-F-D-A-Footprint-2]
J6  QSE-020-01-F-D-A  [QSE-020-01-F-D-A-Footprint-2]
J7  QSE-020-01-F-D-A  [QSE-020-01-F-D-A-Footprint-2]
J11  QSE-020-01-F-D-A  [QSE-020-01-F-D-A-Footprint-2]
PTH3  SYZYGY_PCB_Mounting_Hole  [SYZYGY_PCB_Mounting_Hole]  (value not drawn)  (no BOM)
PTH4  SYZYGY_PCB_Mounting_Hole  [SYZYGY_PCB_Mounting_Hole]  (value not drawn)  (mechanical)
PTH6  SYZYGY_PCB_Mounting_Hole  [SYZYGY_PCB_Mounting_Hole]  (value not drawn)  (no BOM)
PTH7  SYZYGY_PCB_Mounting_Hole  [SYZYGY_PCB_Mounting_Hole]  (value not drawn)  (mechanical)
PTH9  SYZYGY_PCB_Mounting_Hole  [SYZYGY_PCB_Mounting_Hole]  (value not drawn)  (mechanical)
PTH10  SYZYGY_PCB_Mounting_Hole  [SYZYGY_PCB_Mounting_Hole]  (value not drawn)  (mechanical)
PTH11  SYZYGY_PCB_Mounting_Hole  [SYZYGY_PCB_Mounting_Hole]  (value not drawn)  (no BOM)
PTH12  SYZYGY_PCB_Mounting_Hole  [SYZYGY_PCB_Mounting_Hole]  (value not drawn)  (no BOM)
PTH13  SYZYGY_PCB_Mounting_Hole  [SYZYGY_PCB_Mounting_Hole]  (value not drawn)  (no BOM)
PTH14  SYZYGY_PCB_Mounting_Hole  [SYZYGY_PCB_Mounting_Hole]  (value not drawn)  (no BOM)
PTH15  SYZYGY_PCB_Mounting_Hole  [SYZYGY_PCB_Mounting_Hole]  (value not drawn)  (no BOM)
PTH16  SYZYGY_PCB_Mounting_Hole  [SYZYGY_PCB_Mounting_Hole]  (value not drawn)  (no BOM)

### Blocks framed on the sheet
SOM PERIPHERAL CONNECTIONS: J7 J11 PTH4 PTH7 PTH15 PTH16
SOM I/O CONNECTIONS: J5 J6 PTH3 PTH6 PTH9 PTH10

### Nets
3V3: J5.40 J6.40
5V: J5.2 J6.2
GND: J5.G1(GND) J5.G2(GND) J5.G3(GND) J5.G4(GND) J6.G1(GND) J6.G2(GND) J6.G3(GND) J6.G4(GND) J7.G1(GND) J7.G2(GND) J7.G3(GND) J7.G4(GND) J11.G1(GND) J11.G2(GND) J11.G3(GND) J11.G4(GND)
SYZGY_VIO_1: J5.39
SYZGY_VIO_2: J6.39
BTN1: J11.33
BTN2: J11.35
C_DONE: J7.18
C_REST: J7.20
ESPI_CLK: J11.30
ESPI_CS: J11.32
ESPI_PICO: J11.34
ESPI_POCI: J11.28
ETH_MDC: J7.32
ETH_MDI_O: J7.30
HOLD: J7.16
LED3_A: J11.5
LED4_A: J11.7
NSTATUS: J11.9
OTG_RESETB: J7.25
PD_INT_N: J11.40
PD_SCL: J11.38
PD_SDA: J11.36
R_GA: J5.4
R_GA_2: J6.4
RMII_CRS_DV: J7.27
RMII_REF_CLK: J7.35
RMII_RX_0: J7.37
RMII_RX_1: J7.39
RMII_TX_0: J7.31
RMII_TX_1: J7.33
RMII_TXEN: J7.29
RXD: J7.6
~{SD_CS}: J7.34
~{SYZGY_VIO_1_1V8}: J11.37
~{SYZGY_VIO_1_2V5}: J11.39
~{SYZGY_VIO_2_1V8}: J11.1
~{SYZGY_VIO_2_2V5}: J11.3
SD_DI: J7.36
SD_DO: J7.40
SD_SCLK: J7.38
SFLASH_PWR: J7.2
SPI_MISO: J7.24
SPI_MOSI: J7.26
SPI_SCLK: J7.28
SPI_SS: J7.22
SYZYGY_1_C2P_CLKN: J5.36
SYZYGY_1_C2P_CLKP: J5.34
SYZYGY_1_I/O_5: J5.6
SYZYGY_1_I/O_6: J5.5
SYZYGY_1_I/O_7: J5.8
SYZYGY_1_I/O_8: J5.7
SYZYGY_1_I/O_9: J5.10
SYZYGY_1_I/O_10: J5.9
SYZYGY_1_I/O_11: J5.12
SYZYGY_1_I/O_12: J5.11
SYZYGY_1_I/O_13: J5.14
SYZYGY_1_I/O_14: J5.13
SYZYGY_1_I/O_15: J5.16
SYZYGY_1_I/O_16: J5.15
SYZYGY_1_I/O_17: J5.18
SYZYGY_1_I/O_18: J5.17
SYZYGY_1_I/O_19: J5.20
SYZYGY_1_I/O_20: J5.19
SYZYGY_1_I/O_21: J5.22
SYZYGY_1_I/O_22: J5.21
SYZYGY_1_I/O_23: J5.24
SYZYGY_1_I/O_24: J5.23
SYZYGY_1_I/O_25: J5.26
SYZYGY_1_I/O_26: J5.25
SYZYGY_1_I/O_27: J5.28
SYZYGY_1_I/O_28: J5.27
SYZYGY_1_I/O_29: J5.30
SYZYGY_1_I/O_30: J5.29
SYZYGY_1_I/O_31: J5.32
SYZYGY_1_I/O_32: J5.31
SYZYGY_1_P2C_CLKN: J5.35
SYZYGY_1_P2C_CLKP: J5.33
SYZYGY_1_SDA: J5.3
SYZYGY_1_SDL: J5.1
SYZYGY_2_C2P_CLKN: J6.36
SYZYGY_2_C2P_CLKP: J6.34
SYZYGY_2_I/O_5: J6.6
SYZYGY_2_I/O_6: J6.5
SYZYGY_2_I/O_7: J6.8
SYZYGY_2_I/O_8: J6.7
SYZYGY_2_I/O_9: J6.10
SYZYGY_2_I/O_10: J6.9
SYZYGY_2_I/O_11: J6.12
SYZYGY_2_I/O_12: J6.11
SYZYGY_2_I/O_13: J6.14
SYZYGY_2_I/O_14: J6.13
SYZYGY_2_I/O_15: J6.16
SYZYGY_2_I/O_16: J6.15
SYZYGY_2_I/O_17: J6.18
SYZYGY_2_I/O_18: J6.17
SYZYGY_2_I/O_19: J6.20
SYZYGY_2_I/O_20: J6.19
SYZYGY_2_I/O_21: J6.22
SYZYGY_2_I/O_22: J6.21
SYZYGY_2_I/O_23: J6.24
SYZYGY_2_I/O_24: J6.23
SYZYGY_2_I/O_25: J6.26
SYZYGY_2_I/O_26: J6.25
SYZYGY_2_I/O_27: J6.28
SYZYGY_2_I/O_28: J6.27
SYZYGY_2_I/O_29: J6.30
SYZYGY_2_I/O_30: J6.29
SYZYGY_2_I/O_31: J6.32
SYZYGY_2_I/O_32: J6.31
SYZYGY_2_P2C_CLKN: J6.35
SYZYGY_2_P2C_CLKP: J6.33
SYZYGY_2_SDA: J6.3
SYZYGY_2_SDL: J6.1
TCK: J7.14
TDI: J7.12
TDO: J7.10
TEST_N: J11.11
TMS: J7.8
TXD: J7.4
ULPI_CLKOUT: J7.19
ULPI_DATA0: J7.15
ULPI_DATA1: J7.13
ULPI_DATA2: J7.11
ULPI_DATA3: J7.9
ULPI_DATA4: J7.7
ULPI_DATA5: J7.5
ULPI_DATA6: J7.3
ULPI_DATA7: J7.1
ULPI_DIR: J7.21
ULPI_NXT: J7.17
ULPI_STP: J7.23

Not connected (* = marked no-connect by the designer): J5 37* 38*; J6 37* 38*; J11 2* 4* 6* 8* 10* 12* 13* 14* 15* 16* 17* 18* 19* 20* 21* 22* 23* 24* 25* 26* 27* 29* 31*; PTH3 1*; PTH4 1*; PTH6 1*; PTH7 1*; PTH9 1*; PTH10 1*; PTH11 1*; PTH12 1*; PTH13 1*; PTH14 1*; PTH15 1*; PTH16 1*

### Notes on the sheet
- MOUNTING HOLES
- Title:
- Project:
- Size:
- Date:
- File:
- A3
- Time:
- Drawn By:
- Sheet:
- Revision:
- Of

### Library data of the parts
?#6 = Title_Block
J5-J7 J11 = CMP-002-00073-2_2: Conn High Speed Socket Strip SKT 40 POS 0.8mm Solder ST SMD Tray